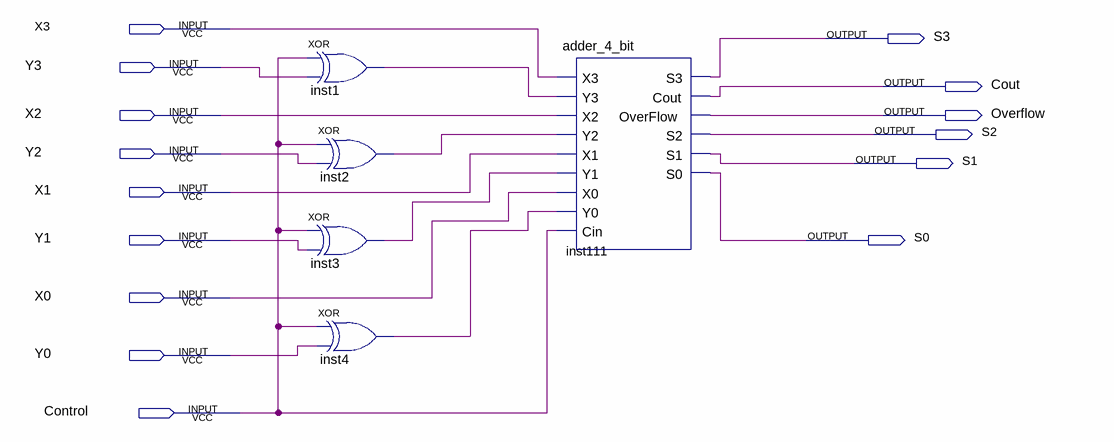
[diagram p0: schematic sheet]
// Quartus schematic 4-BitRippleCarryAdder.bdf as structural Verilog: 5 symbols, 15 pins
module \4-BitRippleCarryAdder  (
  input  X3,
  input  Y3,
  input  X2,
  input  Y2,
  input  X1,
  input  Y1,
  input  X0,
  input  Y0,
  input  Control,
  output S3,
  output Cout,
  output Overflow,
  output S2,
  output S1,
  output S0
);

  wire inst1_out, inst2_out, inst3_out, inst4_out;

  xor inst1 (inst1_out, Control, Y3);
  xor inst2 (inst2_out, Control, Y2);
  xor inst3 (inst3_out, Control, Y1);
  xor inst4 (inst4_out, Control, Y0);
  adder_4_bit inst111 (
    .X3(X3), .Y3(inst1_out), .X2(X2), .Y2(inst2_out), .X1(X1), .Y1(inst3_out), .X0(X0), .Y0(inst4_out),
    .Cin(Control), .S3(S3), .Cout(Cout), .OverFlow(Overflow), .S2(S2), .S1(S1), .S0(S0));
endmodule
